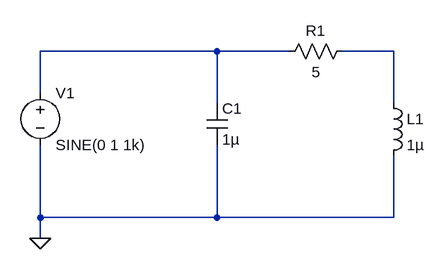
[diagram p0: schematic Draft1.asc]
Draft1.asc, the LTspice schematic file:
Version 4.1
SHEET 1 880 680
WIRE 208 16 -64 16
WIRE 320 16 208 16
WIRE 480 16 400 16
WIRE -64 80 -64 16
WIRE 208 96 208 16
WIRE 480 96 480 16
WIRE -64 272 -64 160
WIRE 208 272 208 160
WIRE 208 272 -64 272
WIRE 480 272 480 176
WIRE 480 272 208 272
WIRE -64 304 -64 272
FLAG -64 304 0
SYMBOL voltage -64 64 R0
WINDOW 123 0 0 Left 0
WINDOW 39 0 0 Left 0
SYMATTR InstName V1
SYMATTR Value SINE(0 1 1k)
SYMBOL cap 192 96 R0
SYMATTR InstName C1
SYMATTR Value 1µ
SYMBOL ind 464 80 R0
SYMATTR InstName L1
SYMATTR Value 1µ
SYMBOL res 304 32 R270
WINDOW 0 32 56 VTop 2
WINDOW 3 0 56 VBottom 2
SYMATTR InstName R1
SYMATTR Value 5

The netlist it stands for:
* Draft1.asc
V1 N001 0 SINE(0 1 1k)
C1 N001 0 1µ
L1 N002 0 1µ
R1 N001 N002 5
.backanno
.end